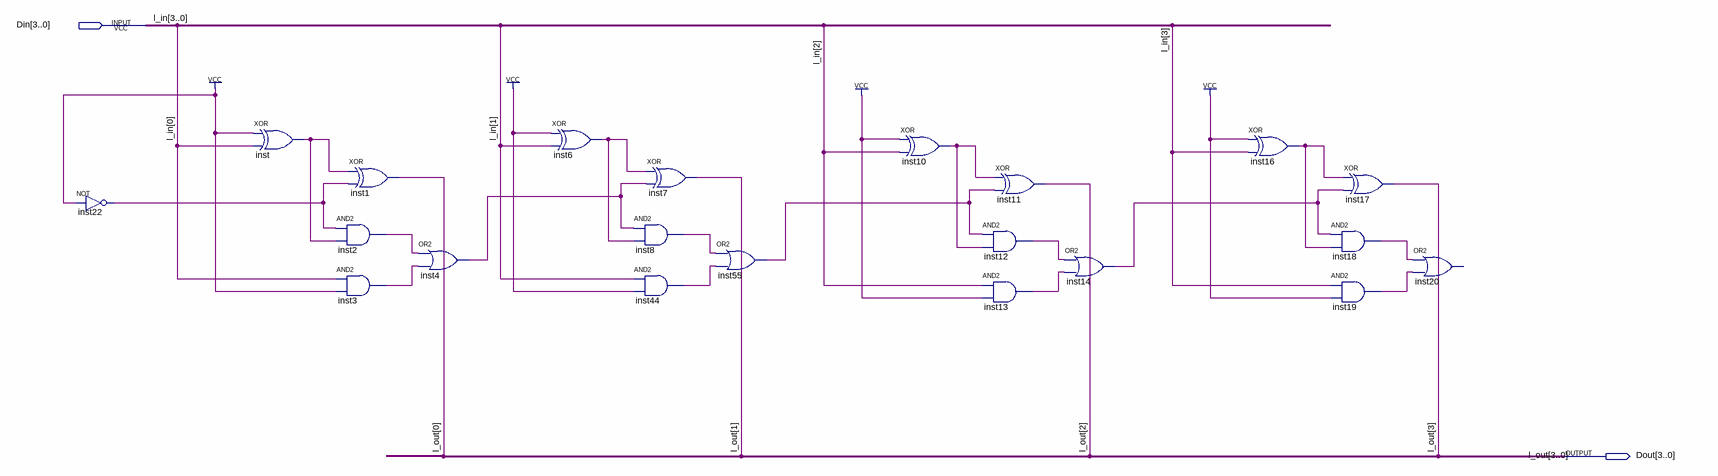
[diagram p0: schematic sheet]
// Quartus schematic decre_4bit.bdf as structural Verilog: 21 symbols, 2 pins
module decre_4bit (
  input  [3:0] Din,
  output [3:0] Dout
);

  wire inst2_out, inst3_out, inst4_out, inst6_out, inst8_out, inst10_out, inst12_out, inst13_out, inst14_out,
       inst16_out, inst18_out, inst19_out, inst22_out, inst44_out, inst55_out, inst_out;

  not inst22 (inst22_out, 1'b1);
  xor inst (inst_out, 1'b1, Din[0]);
  xor inst1 (Dout[0], inst_out, inst22_out);
  and inst2 (inst2_out, inst22_out, inst_out);
  and inst3 (inst3_out, Din[0], 1'b1);
  or inst4 (inst4_out, inst2_out, inst3_out);
  xor inst6 (inst6_out, 1'b1, Din[1]);
  and inst8 (inst8_out, inst4_out, inst6_out);
  and inst44 (inst44_out, Din[1], 1'b1);
  xor inst7 (Dout[1], inst6_out, inst4_out);
  or inst55 (inst55_out, inst8_out, inst44_out);
  xor inst10 (inst10_out, 1'b1, Din[2]);
  and inst12 (inst12_out, inst55_out, inst10_out);
  and inst13 (inst13_out, Din[2], 1'b1);
  xor inst11 (Dout[2], inst10_out, inst55_out);
  or inst14 (inst14_out, inst12_out, inst13_out);
  xor inst16 (inst16_out, 1'b1, Din[3]);
  xor inst17 (Dout[3], inst16_out, inst14_out);
  and inst18 (inst18_out, inst14_out, inst16_out);
  and inst19 (inst19_out, Din[3], 1'b1);
  // OR2 inst20 has open pins: IN1=inst18_out, IN2=inst19_out, OUT=open

  // Other names for the same wires on the sheet: l_in[3:0] = Din; l_out[3:0] = Dout
endmodule
